# Altium schematic sheet MAIN.SchDoc
size A4; PageSetup: Record=PageOptions|CenterHorizontal=True|CenterVertical=True|PrintScale=0.94|XCorrection=1.00|YCorrection=1.00|PrintKind=0|BorderSize=5000000|LeftOffset=0|BottomOffset=0|Orientation=2|PaperLength=1000|PaperWidth=1000|Scale=100|PaperSource=7|PrintQuality=-3|MediaType=1|DitherType=10|PrintScaleMode=1|PaperKind=Letter|PaperIndex=1
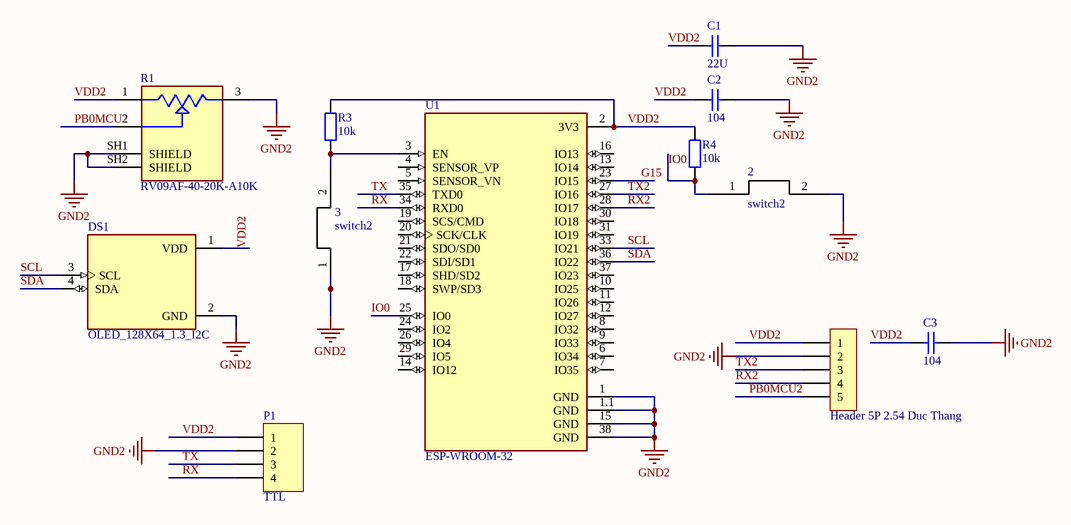
[diagram p0: MAIN.SchDoc]

## Parts
2  switch2  [switch]
3  switch2  [switch]
C1  22U  [tu 0805]
C2  104  [tu 0805]
C3  104  [tu 0805]
DS1  OLED_128X64_1.3_I2C  [LCD_OLED_128X64_1.3_I2C - duplicate]
H1  Header 5P 2.54 Duc Thang  [XH2.54M-5]
P1  TTL  [HDR1X4]
R1  RV09AF-40-20K-A10K  [TRIM_RV09AF-40-20K-A10K]
R3  10k  [tro smd 0805]
R4  10k  [tro smd 0805]
U1  ESP-WROOM-32  [MODULE_ESP-WROOM-32]

## Nets
GND2: 2.2 3.1 C1.1 C2.1 C3.1 DS1.2(GND) H1.2 P1.2 R1.3 R1.SH1(SHIELD) R1.SH2(SHIELD) U1.1(GND) U1.1.1(GND) U1.15(GND) U1.38(GND)
G15: U1.23(IO15)
IO0: 2.1 R4.1 U1.25(IO0)
PB0MCU2: H1.5 R1.2
RX: P1.4 U1.34(RXD0)
RX2: H1.4 U1.28(IO17)
SCL: DS1.3(SCL) U1.33(IO21)
SDA: DS1.4(SDA) U1.36(IO22)
TX: P1.3 U1.35(TXD0)
TX2: H1.3 U1.27(IO16)
VDD2: C1.2 C2.2 C3.2 DS1.1(VDD) H1.1 P1.1 R1.1 R3.1 R4.2 U1.2(3V3)
Net3_2: 3.2 R3.2 U1.3(EN)

Not connected (* = marked no-connect by the designer): U1 4(SENSOR_VP) 5(SENSOR_VN) 6(IO34) 7(IO35) 8(IO32) 9(IO33) 10(IO25) 11(IO26) 12(IO27) 13(IO14) 14(IO12) 16(IO13) 17(SHD/SD2) 18(SWP/SD3) 19(SCS/CMD) 20(SCK/CLK) 21(SDO/SD0) 22(SDI/SD1) 24(IO2) 26(IO4) 29(IO5) 30(IO18) 31(IO19) 37(IO23)

## Notes on the sheet
- Title
- Size:
- Date:
- A4
- Number:
- Time:
- Revision:
- Sheet
- of
- File:

## Library data of the parts
C1 = Tu 0805 225 25V 10%: Dán; Don_Vi: Con; So_Chan: 2; Ten_Linh_Kien: Tụ 0805 225-2.2uF 25V 10%; Ma_Hang: MH007483; Chung_Loai: Dán; Kieu_Chan: *
C2 C3 = Tu 0805 104 50V 10%: Dán; Don_Vi: Con; So_Chan: 2; Ten_Linh_Kien: Tụ 0805 104-100nF 10% 50V; Ma_Hang: MH004551; Chung_Loai: Dán; Kieu_Chan: *
DS1 = OLED_128X64_1.3_I2C: Non-Touch Graphic LCD Display Module Transmissive White OLED, Monochrome I2C 1.3 (33.02mm) 128 x 64; MF: UNIVERSAL-SOLDER Electronics Ltd; MP: OLED 128x64 1.3&quot; I2C; SnapEDA_Link: https://www.snapeda.com/parts/OLED%20128x64%201.3%22%20I2C/UNIVERSAL-SOLDER+Electronics+Ltd/view-part/?ref=snap; Package: None; Value: *; Check_prices: https://www.snapeda.com/parts/OLED%20128x64%201.3%22%20I2C/UNIVERSAL-SOLDER+Electronics+Ltd/view-part/?ref=eda
H1 = Header 5P 2.54 Duc Thang: Cắm; Ten_Linh_Kien: Header 5P XH2.54-5P Đực Thẳng; Don_Vi: Con; Ma_Hang: MH001298; Chung_Loai: Cắm
P1 = Header 4: Header, 4-Pin; LatestRevisionDate: 17-Jul-2002; LatestRevisionNote: Re-released for DXP Platform.; Publisher: Altium Limited
R1 = RV09AF-40-20K-A10K: PC Mount Black Shaft Potentiometers Audio 9mm 10K; MF: Alpha Taiwan; SnapEDA_Link: https://www.snapeda.com/parts/RV09AF-40-20K-A10K/Alpha/view-part/?ref=snap; Package: None; Value: *; MP: RV09AF-40-20K-A10K; Check_prices: https://www.snapeda.com/parts/RV09AF-40-20K-A10K/Alpha/view-part/?ref=eda
R3 R4 = Tro 0805 1% 0.33R: Dán; Don_Vi: Con; So_Chan: 2; Ten_Linh_Kien: Trở 0805 1% 0.33R; Ma_Hang: MH005467; Chung_Loai: Dán; Kieu_Chan: *
U1 = ESP-WROOM-32: Transceptor serie ESP-WROOM-32; Placa de evaluaciÃ³n 802.11 b/g/n (Wi-Fi, WiFi, WLAN), BluetoothÂ® Smart 4.x de bajo consumo (BLE); MF: Espressif Systems; SnapEDA_Link: https://www.snapeda.com/parts/ESP-WROOM-32/Espressif+Systems/view-part/?ref=snap; Package: Module Espressif Systems; Value: *; MP: ESP-WROOM-32; Check_prices: https://www.snapeda.com/parts/ESP-WROOM-32/Espressif+Systems/view-part/?ref=eda